# Altium schematic sheet POW_Schematic3.SchDoc
size A4
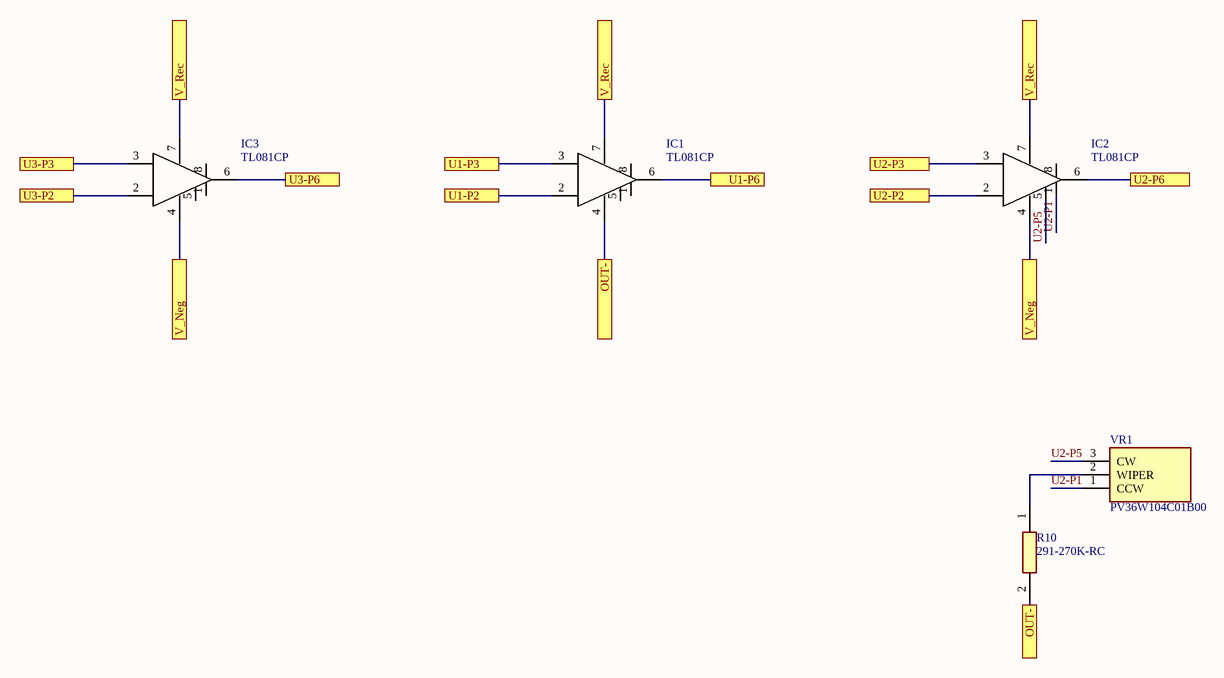
[diagram p0: POW_Schematic3.SchDoc]

## Parts
IC1  TL081CP  [DIP794W53P254L959H508Q8N]
IC2  TL081CP  [DIP794W53P254L959H508Q8N]
IC3  TL081CP  [DIP794W53P254L959H508Q8N]
R10  291-270K-RC  [291-XXX-RC-Type]
VR1  PV36W104C01B00  [PV36W]

## Ports
OUT-, U1-P2, U1-P3, U1-P6, U2-P2, U2-P3, U2-P6, U3-P2, U3-P3, U3-P6, V_Neg, V_Rec

## Nets
OUT-: IC1.4 R10.2 ; port OUT-
U1-P2: IC1.2 ; port U1-P2
U1-P3: IC1.3 ; port U1-P3
U1-P6: IC1.6 ; port U1-P6
U2-P1: IC2.1 VR1.1(CCW)
U2-P2: IC2.2 ; port U2-P2
U2-P3: IC2.3 ; port U2-P3
U2-P5: IC2.5 VR1.3(CW)
U2-P6: IC2.6 ; port U2-P6
U3-P2: IC3.2 ; port U3-P2
U3-P3: IC3.3 ; port U3-P3
U3-P6: IC3.6 ; port U3-P6
V_Neg: IC2.4 IC3.4 ; port V_Neg
V_Rec: IC1.7 IC2.7 IC3.7 ; port V_Rec
NetR10_1: R10.1 VR1.2(WIPER)

Not connected (* = marked no-connect by the designer): IC1 1 5 8; IC2 8; IC3 1 5 8

## Library data of the parts
IC1-IC3 = TL081CP: Integrated Circuit; Manufacturer_Name: Texas Instruments; Datasheet Link: http://www.ti.com/lit/ds/symlink/tl081a.pdf; Height: 5.08mm; Manufacturer_Part_Number: TL081CP; Mouser Part Number: 595-TL081CP; Mouser Price/Stock: https://www.mouser.com/Search/Refine.aspx?Keyword=595-TL081CP; RS Part Number: 0304223P; RS Price/Stock: http://uk.rs-online.com/web/p/products/0304223P
VR1 = PV36W104C01B00: Variable Resistor; Manufacturer_Name: Bourns; Allied_Number: 71024705; Datasheet Link: https://www.bourns.com/docs/Product-Datasheets/pv36.pdf; Manufacturer_Part_Number: PV36W104C01B00; Mouser Part Number: 81-PV36W104C01B00; Mouser Price/Stock: https://www.mouser.com/Search/Refine.aspx?Keyword=81-PV36W104C01B00; RS Part Number: 7692160P; RS Price/Stock: http://uk.rs-online.com/web/p/products/7692160P; Allied Price/Stock: https://www.alliedelec.com/bourns-pv36w104c01b00/71024705/